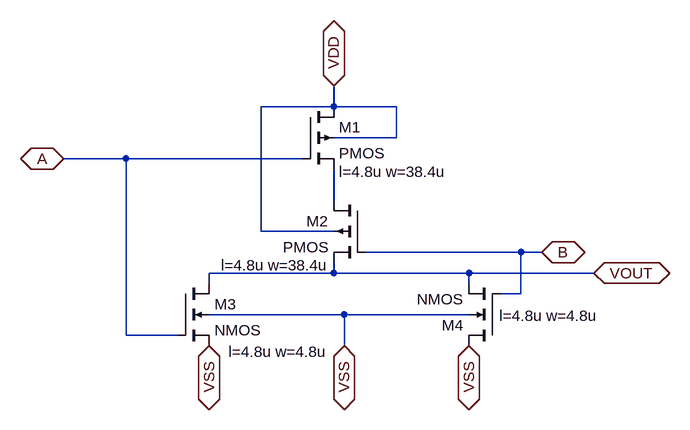
[diagram p0: schematic N_OR.asc]
N_OR.asc, the LTspice schematic file:
Version 4
SHEET 1 880 680
WIRE 192 48 192 16
WIRE 192 48 80 48
WIRE 288 48 192 48
WIRE 288 96 288 48
WIRE 288 96 192 96
WIRE -128 128 -224 128
WIRE 144 128 -128 128
WIRE 192 192 192 144
WIRE 80 240 80 48
WIRE 192 240 80 240
WIRE 480 272 240 272
WIRE 512 272 480 272
WIRE 192 304 192 288
WIRE 192 304 0 304
WIRE 400 304 192 304
WIRE 592 304 400 304
WIRE 0 320 0 304
WIRE 400 320 400 304
WIRE 480 336 480 272
WIRE 480 336 448 336
WIRE 208 368 0 368
WIRE 400 368 208 368
WIRE -128 400 -128 128
WIRE -48 400 -128 400
WIRE 208 416 208 368
FLAG 512 272 B
IOPIN 512 272 BiDir
FLAG 192 16 VDD
IOPIN 192 16 BiDir
FLAG 592 304 VOUT
IOPIN 592 304 BiDir
FLAG -224 128 A
IOPIN -224 128 BiDir
FLAG 0 416 VSS
IOPIN 0 416 BiDir
FLAG 208 416 VSS
IOPIN 208 416 BiDir
FLAG 400 416 VSS
IOPIN 400 416 BiDir
SYMBOL pmos4 144 48 R0
WINDOW 123 56 100 Left 2
SYMATTR Value2 l=4.8u w=38.4u
SYMATTR InstName M1
SYMBOL pmos4 240 192 M0
WINDOW 123 56 100 Left 2
SYMATTR Value2 l=4.8u w=38.4u
SYMATTR InstName M2
SYMBOL nmos4 -48 320 R0
WINDOW 123 78 105 Left 2
SYMATTR Value2 l=4.8u w=4.8u
SYMATTR InstName M3
SYMBOL nmos4 448 416 R180
WINDOW 123 -151 46 Left 2
SYMATTR Value2 l=4.8u w=4.8u
SYMATTR InstName M4

The netlist it stands for:
* N_OR.asc
M1 VDD A N001 VDD PMOS l=4.8u w=38.4u
M2 N001 B VOUT VDD PMOS l=4.8u w=38.4u
M3 VOUT A VSS VSS NMOS l=4.8u w=4.8u
M4 VSS B VOUT VSS NMOS l=4.8u w=4.8u
.model NMOS NMOS
.model PMOS PMOS
.lib standard.mos
.backanno
.end